# Altium schematic sheet card.SchDoc
size A4
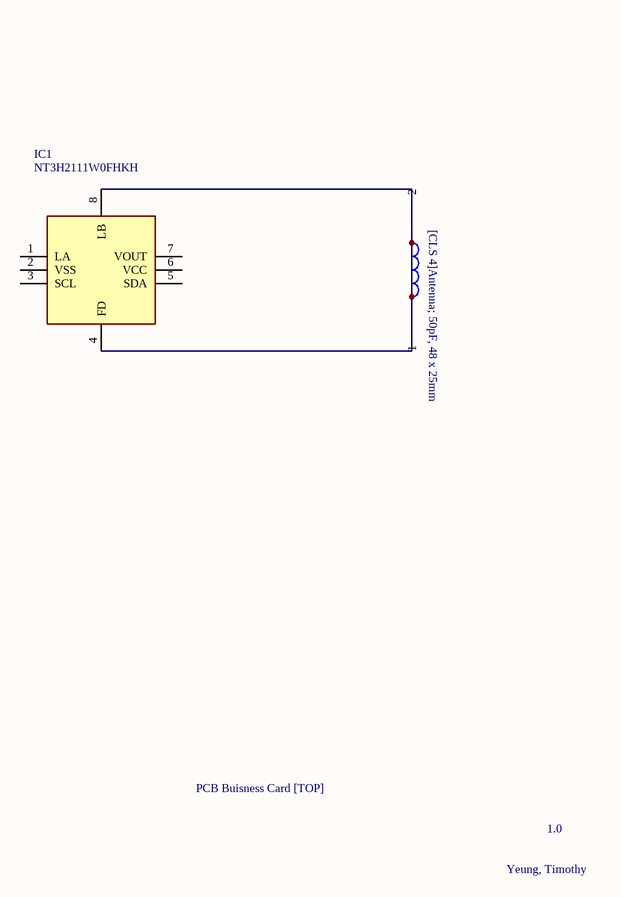
[diagram p0: card.SchDoc]

## Parts
*  Antenna_Class4  [Class4_Antenna]  (value not drawn)
IC1  NT3H2111W0FHKH  [QFN50P160X160X50-8N]

## Nets
Net*_1: *.1 *.2 IC1.4(FD) IC1.8(LB)

Not connected (* = marked no-connect by the designer): IC1 1(LA) 2(VSS) 3(SCL) 5(SDA) 6(VCC) 7(VOUT)

## Notes on the sheet
- PCB Buisness Card [TOP]
- 1.0
- Yeung, Timothy
- (in symbol Antenna_Class4) [CLS 4]Antenna; 50pF, 48 x 25mm

## Library data of the parts
IC1 = NT3H2111W0FHKH: Integrated Circuit; Manufacturer_Name: Nexperia; Datasheet Link: http://www.nxp.com/docs/en/data-sheet/NT3H2111_2211.pdf; Height: 0.5mm; Manufacturer_Part_Number: NT3H2111W0FHKH; Mouser Part Number: 771-NT3H2111W0FHKH; Mouser Price/Stock: https://www.mouser.com/Search/Refine.aspx?Keyword=771-NT3H2111W0FHKH; ComponentLink1Description: Datasheet; ComponentLink1URL: https://www.nxp.com/docs/en/data-sheet/NT3H2111_2211.pdf; Supplier 1: Digi-Key; Supplier Part Number 1: 568-12901-6-ND